# Altium project pca10090.PrjPCB (part 2 of 5)

## Sheet pca10090_sheet3_nrf52840.SchDoc: PCA10090 - nRF52840
size A3; Organization: Nordic Semiconductor; DocumentNumber: 3; Revision: 0.15.0; SheetNumber: 3; SheetTotal: 8; Author: RUBR; CompanyName: Nordic Semiconductor; DrawnBy: RUBR; DocumentSize: A3; ProjectName: nRF9160-DK
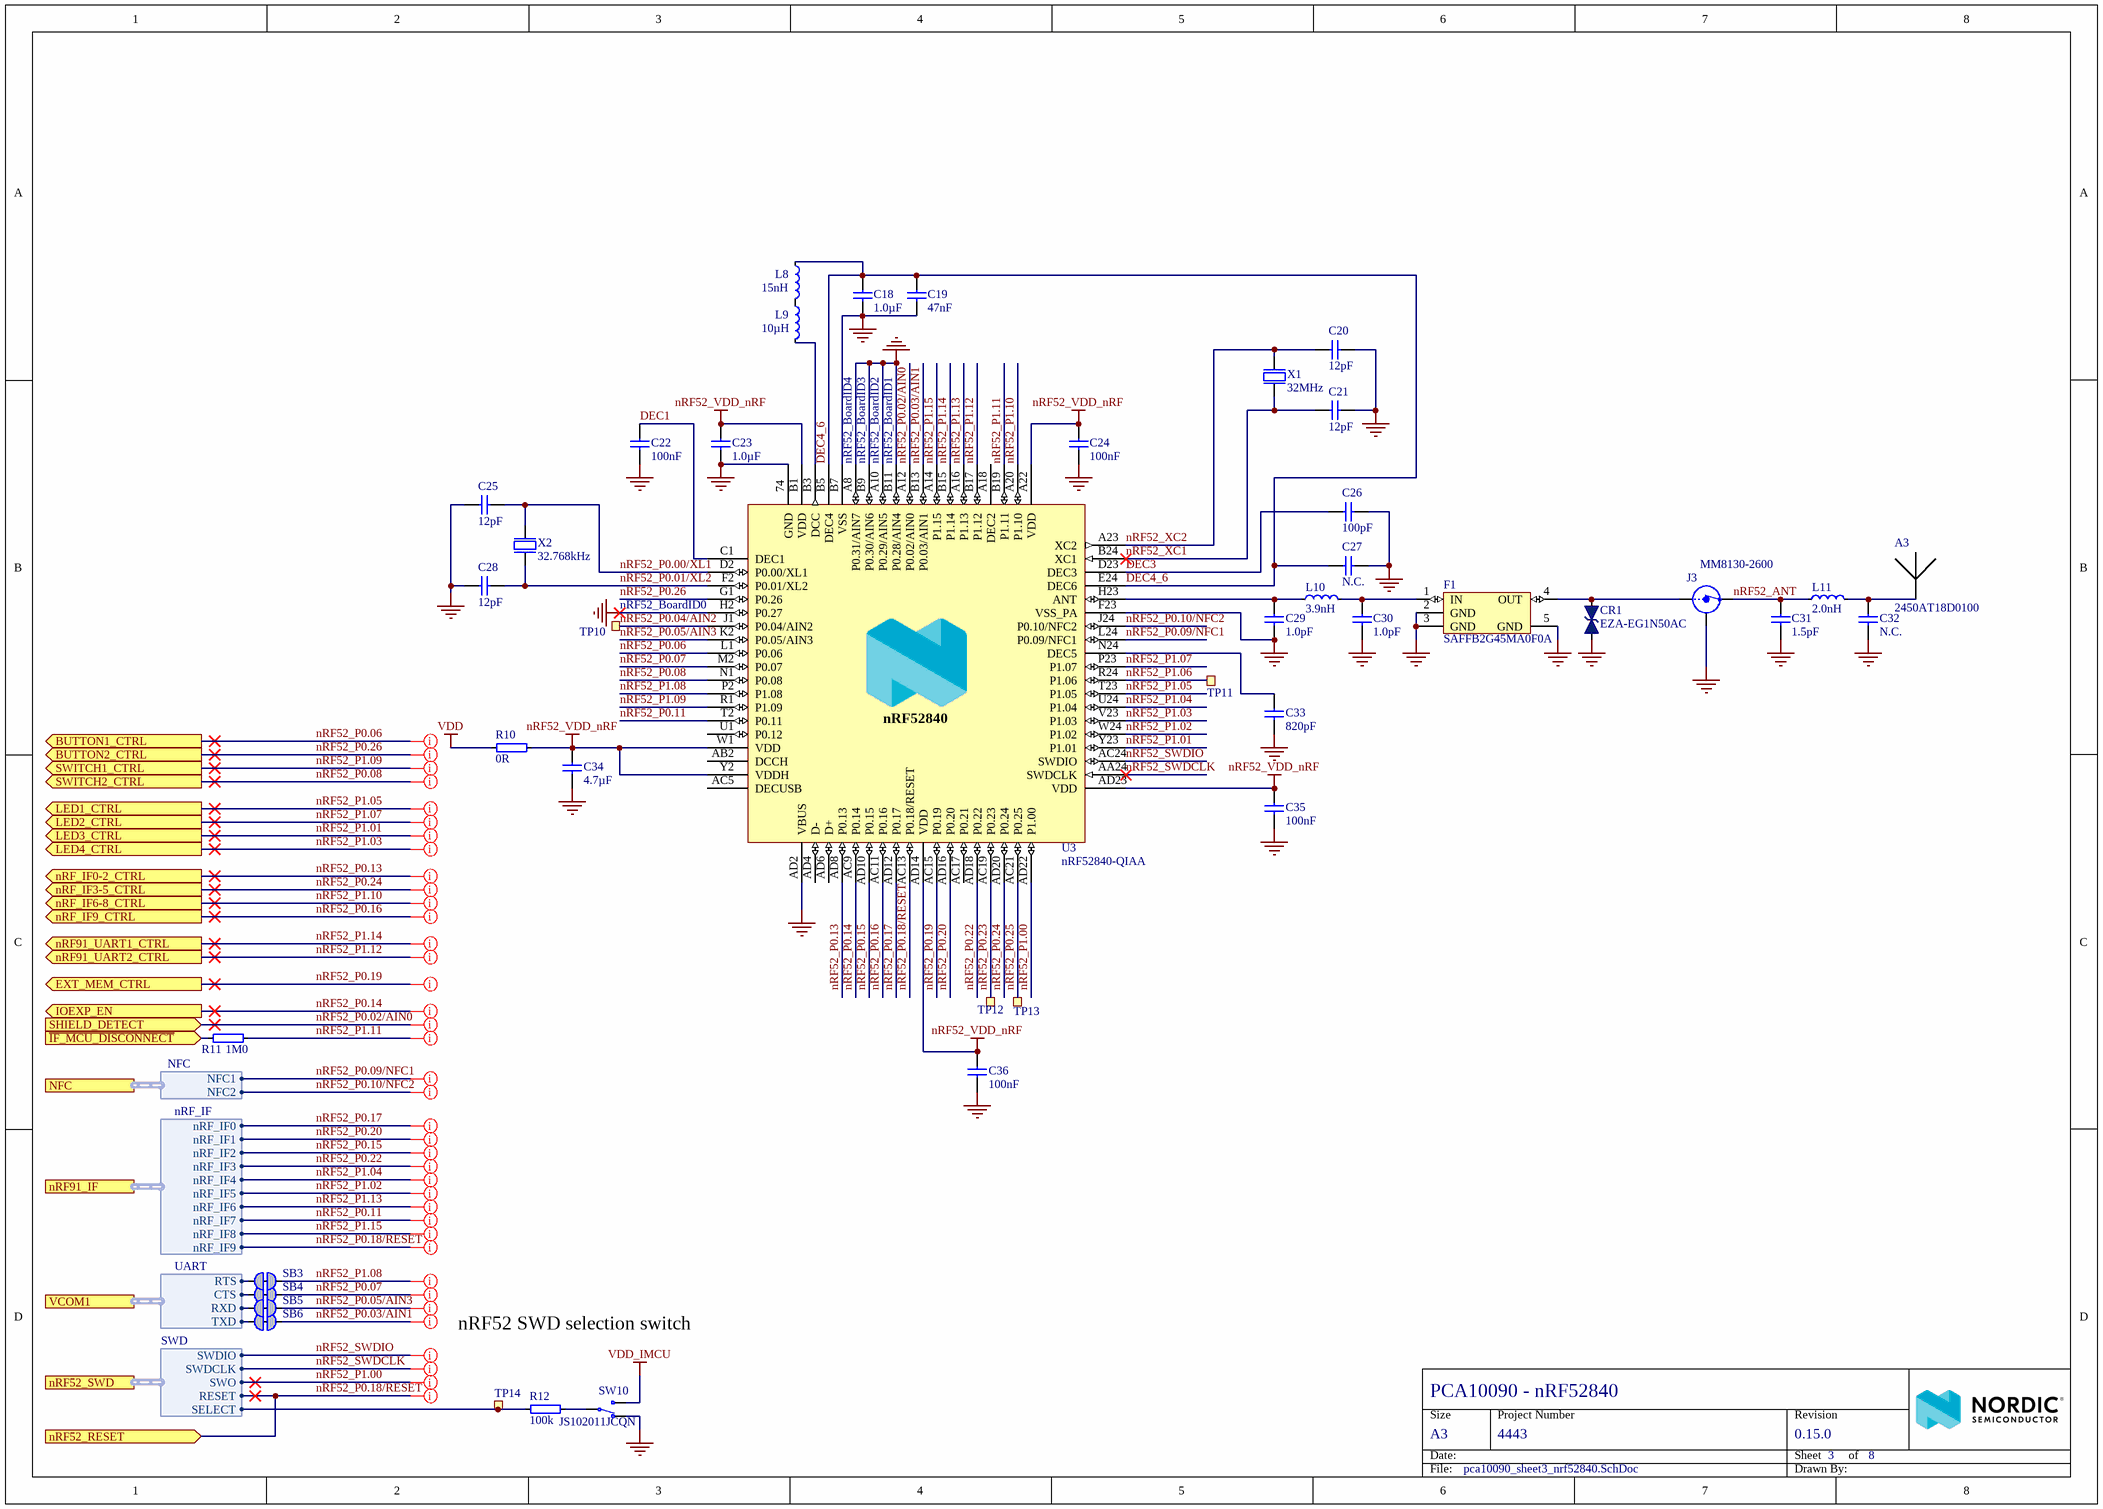
[diagram p2: pca10090_sheet3_nrf52840.SchDoc]

### Parts
A3  2450AT18D0100  [2450AT18D0100_STD-L]
C18  1.0µF  [CAPC1005X04L]
C19  47nF  [CAPC0603X03L_C]
C20  12pF  [CAPC0603X03L_C]
C21  12pF  [CAPC0603X03L_C]
C22  100nF  [CAPC0603X03L_C]
C23  1.0µF  [CAPC1005X04L]
C24  100nF  [CAPC0603X03L_C]
C25  12pF  [CAPC0603X03L_C]
C26  100pF  [CAPC0603X03L_C]
C27  N.C.  [CAPC0603X03L_C_NC]
C28  12pF  [CAPC0603X03L_C]
C29  1.0pF  [CAPC0603X03L_C]
C30  1.0pF  [CAPC0603X03L_C]
C31  1.5pF  [CAPC0603X03L_C]
C32  N.C.  [CAPC0603X03L_C_NC]
C33  820pF  [CAPC0603X03L_C]
C34  4.7µF  [CAPC1608X06L]
C35  100nF  [CAPC0603X03L_C]
C36  100nF  [CAPC0603X03L_C]
CR1  EZA-EG1N50AC  [RESC0603X03L_C]
F1  SAFFB2G45MA0F0A  [SAFFB2G45MA0F0A]
J3  MM8130-2600  [COAXIAL-SWF]
L8  15nH  [INDC1005X04L]
L9  10µH  [INDC1608X06L]
L10  3.9nH  [INDC0603X03L_C]
L11  2.0nH  [INDC0603X03L_C]
R10  0R  [RESC0603X03L_C]
R11  1M0  [RESC0603X03L_C]
R12  100k  [RESC0603X03L_C]
SB3  Solderbridge  [Solderbridge_Shorted]  (value not drawn)  (net tie, no BOM)
SB4  Solderbridge  [Solderbridge_Shorted]  (value not drawn)  (net tie, no BOM)
SB5  Solderbridge  [Solderbridge_Shorted]  (value not drawn)  (net tie, no BOM)
SB6  Solderbridge  [Solderbridge_Shorted]  (value not drawn)  (net tie, no BOM)
SW10  JS102011JCQN  [JS102011JCQN]
TP10  Ø1.5mm,SMD  [TP_SMD_Ø1.5mm]  (value not drawn)  (no BOM)
TP11  Ø1.5mm,SMD  [TP_SMD_Ø1.5mm]  (value not drawn)  (no BOM)
TP12  Ø1.5mm,SMD  [TP_SMD_Ø1.5mm]  (value not drawn)  (no BOM)
TP13  Ø1.5mm,SMD  [TP_SMD_Ø1.5mm]  (value not drawn)  (no BOM)
TP14  Ø1.5mm,SMD  [TP_SMD_Ø1.5mm]  (value not drawn)  (no BOM)
U3  nRF52840-QIAA  [AQFN50P700X700X85_HS-74N]
X1  32MHz  [BT-XTAL_2016]
X2  32.768kHz  [XTAL_3215]

### Ports
BUTTON1_CTRL (out), BUTTON2_CTRL (out), EXT_MEM_CTRL (out), IOEXP_EN (out), LED1_CTRL (out), LED2_CTRL (out), LED3_CTRL (out), LED4_CTRL (out), NFC (harness NFC), nRF52_RESET (in), nRF52_SWD (harness SWD), nRF91_IF (harness nRF_IF), nRF91_UART1_CTRL (out), nRF91_UART2_CTRL (out), nRF_IF0-2_CTRL (out), nRF_IF3-5_CTRL (out), nRF_IF6-8_CTRL (out), nRF_IF9_CTRL (out), SHIELD_DETECT (in), SWITCH1_CTRL (out), SWITCH2_CTRL (out), VCOM1 (harness UART), ~{IF_MCU_DISCONNECT} (in)

### Harnesses
UART: RTS, CTS, RXD, TXD
NFC: NFC1, NFC2
SWD: SWDIO, SWDCLK, SWO, RESET, SELECT
nRF_IF: nRF_IF0, nRF_IF1, nRF_IF2, nRF_IF3, nRF_IF4, nRF_IF5, nRF_IF6, nRF_IF7, nRF_IF8, nRF_IF9

### Nets
GND: A3.2(GND) C18.1 C19.1 C20.2 C21.2 C22.1 C23.1 C24.1 C25.1 C26.2 C27.1 C28.2 C29.1 C30.1 C31.2 C32.1 C33.1 C34.1 C35.1 C36.1 CR1.1 F1.2(GND) F1.3(GND) F1.5(GND) J3.2(Shield) SW10.1(N.C) U3.74(GND) U3.A8(P0.31/AIN7) U3.A10(P0.29/AIN5) U3.AD2(VBUS) U3.B7(VSS) U3.B9(P0.30/AIN6) U3.B11(P0.28/AIN4) U3.F23(VSS_PA) U3.H2(P0.27) X1.2(GND) X1.4(GND)
nRF52_VDD_nRF: C23.2 C24.2 C34.2 C35.2 C36.2 R10.2 U3.A22(VDD) U3.AD14(VDD) U3.AD23(VDD) U3.B1(VDD) U3.W1(VDD) U3.Y2(VDDH)
VDD: R10.1
VDD_IMCU: SW10.3(N.O)
DEC1: C22.2 U3.C1(DEC1)
DEC3: C26.1 U3.D23(DEC3)
DEC4_6: C18.2 C19.2 C27.2 L8.1 U3.B5(DEC4) U3.E24(DEC6)
~{IF_MCU_DISCONNECT}: R11.2 ; port ~{IF_MCU_DISCONNECT}
nRF52_ANT: C31.1 J3.3(OUT) L11.1
nRF52_P0.00/XL1: C25.2 U3.D2(P0.00/XL1) X2.1(inp)
nRF52_P0.01/XL2: C28.1 U3.F2(P0.01/XL2) X2.2(out)
nRF52_P0.02/AIN0: U3.A12(P0.02/AIN0) ; port SHIELD_DETECT
nRF52_P0.03/AIN1: SB6.1 U3.B13(P0.03/AIN1)
nRF52_P0.04/AIN2: TP10.1 U3.J1(P0.04/AIN2)
nRF52_P0.05/AIN3: SB5.1 U3.K2(P0.05/AIN3)
nRF52_P0.06: U3.L1(P0.06) ; port BUTTON1_CTRL
nRF52_P0.07: SB4.1 U3.M2(P0.07)
nRF52_P0.08: U3.N1(P0.08) ; port SWITCH2_CTRL
nRF52_P0.09/NFC1: U3.L24(P0.09/NFC1) ; port NFC.NFC1
nRF52_P0.10/NFC2: U3.J24(P0.10/NFC2) ; port NFC.NFC2
nRF52_P0.11: U3.T2(P0.11) ; port nRF91_IF.nRF_IF7
nRF52_P0.13: U3.AD8(P0.13) ; port nRF_IF0-2_CTRL
nRF52_P0.14: U3.AC9(P0.14) ; port IOEXP_EN  [project net IOEXP_EN]
nRF52_P0.15: U3.AD10(P0.15) ; port nRF91_IF.nRF_IF2
nRF52_P0.16: U3.AC11(P0.16) ; port nRF_IF9_CTRL
nRF52_P0.17: U3.AD12(P0.17) ; port nRF91_IF.nRF_IF0
nRF52_P0.18/RESET: U3.AC13(P0.18/RESET) ; port nRF52_RESET, port nRF52_SWD.RESET, port nRF91_IF.nRF_IF9
nRF52_P0.19: U3.AC15(P0.19) ; port EXT_MEM_CTRL
nRF52_P0.20: U3.AD16(P0.20) ; port nRF91_IF.nRF_IF1
nRF52_P0.22: U3.AD18(P0.22) ; port nRF91_IF.nRF_IF3
nRF52_P0.23: TP12.1 U3.AC19(P0.23)
nRF52_P0.24: U3.AD20(P0.24) ; port nRF_IF3-5_CTRL
nRF52_P0.25: TP13.1 U3.AC21(P0.25)
nRF52_P0.26: U3.G1(P0.26) ; port BUTTON2_CTRL
nRF52_P1.00: U3.AD22(P1.00) ; port nRF52_SWD.SWO
nRF52_P1.01: U3.Y23(P1.01) ; port LED3_CTRL
nRF52_P1.02: U3.W24(P1.02) ; port nRF91_IF.nRF_IF5
nRF52_P1.03: U3.V23(P1.03) ; port LED4_CTRL
nRF52_P1.04: U3.U24(P1.04) ; port nRF91_IF.nRF_IF4
nRF52_P1.05: U3.T23(P1.05) ; port LED1_CTRL
nRF52_P1.06: TP11.1 U3.R24(P1.06)
nRF52_P1.07: U3.P23(P1.07) ; port LED2_CTRL
nRF52_P1.08: SB3.1 U3.P2(P1.08)
nRF52_P1.09: U3.R1(P1.09) ; port SWITCH1_CTRL
nRF52_P1.10: U3.A20(P1.10) ; port nRF_IF6-8_CTRL
nRF52_P1.11: R11.1 U3.B19(P1.11)
nRF52_P1.12: U3.B17(P1.12) ; port nRF91_UART2_CTRL
nRF52_P1.13: U3.A16(P1.13) ; port nRF91_IF.nRF_IF6
nRF52_P1.14: U3.B15(P1.14) ; port nRF91_UART1_CTRL
nRF52_P1.15: U3.A14(P1.15) ; port nRF91_IF.nRF_IF8
nRF52_SWDCLK: U3.AA24(SWDCLK) ; port nRF52_SWD.SWDCLK
nRF52_SWDIO: U3.AC24(SWDIO) ; port nRF52_SWD.SWDIO
nRF52_XC1: C21.1 U3.B24(XC1) X1.1(inp)
nRF52_XC2: C20.1 U3.A23(XC2) X1.3(out)
SWD2_SEL: R12.2 TP14.1 ; port nRF52_SWD.SELECT
VCOM1_CTS: SB4.2 ; port VCOM1.CTS
VCOM1_RTS: SB3.2 ; port VCOM1.RTS
VCOM1_RxD: SB5.2 ; port VCOM1.RXD
VCOM1_TxD: SB6.2 ; port VCOM1.TXD
NetA3_1: A3.1 C32.2 L11.2
NetC29_2: C29.2 L10.1 U3.H23(ANT)
NetC30_2: C30.2 F1.1(IN) L10.2
NetC33_2: C33.2 U3.N24(DEC5)
NetCR1_2: CR1.2 F1.4(OUT) J3.1(IN)
NetL8_2: L8.2 L9.1
NetL9_2: L9.2 U3.B3(DCC)
NetR12_1: R12.1 SW10.2(COM)

Not connected (* = marked no-connect by the designer): U3 A18(DEC2) AB2(DCCH) AC5(DECUSB) AC17(P0.21) AD4(D-) AD6(D+) U1(P0.12)

### Layout directives
net class GPIO: IOEXP_EN, nRF52_P0.02/AIN0, nRF52_P0.03/AIN1, nRF52_P0.05/AIN3, nRF52_P0.06, nRF52_P0.07, nRF52_P0.08, nRF52_P0.09/NFC1, nRF52_P0.10/NFC2, nRF52_P0.11, nRF52_P0.13, nRF52_P0.15, nRF52_P0.16, nRF52_P0.17, nRF52_P0.18/RESET, nRF52_P0.19, nRF52_P0.20, nRF52_P0.22, nRF52_P0.24, nRF52_P0.26, nRF52_P1.01, nRF52_P1.02, nRF52_P1.03, nRF52_P1.04, nRF52_P1.05, nRF52_P1.07, nRF52_P1.08, nRF52_P1.09, nRF52_P1.10, nRF52_P1.11, nRF52_P1.12, nRF52_P1.13, nRF52_P1.14, nRF52_P1.15
net class SWD: nRF52_P0.18/RESET, nRF52_P1.00, nRF52_SWDCLK, nRF52_SWDIO

### Notes on the sheet
- nRF52_BoardID4
- (near U3) nRF52_BoardID3
- (near U3) nRF52_BoardID2
- (near U3) nRF52_BoardID1
- (near TP10) nRF52_BoardID0
- nRF52 SWD selection switch
- Size
- Date:
- A3
- Project Number
- Sheet         of
- Revision
- File:
- Drawn By:
- (in symbol nRF52840-QIAAD0) nRF52840

### Library data of the parts
A3 = Johanson 2450AT18D0100_STD-L: 2.45 GHz chip antenna; Manufacturer: Johanson Technology; Part number IPS: 00000001415; Artikkelnr Noca: 53059035; Part Number: Johanson 2450AT18D0100_STD-L; Manufacturer Part Number: 2450AT18D0100; ComponentLink1URL: *; ComponentLink1Description: Datasheet; ComponentLink2URL: *; ComponentLink2Description: Supplier link; HelpURL: http://www.johansontechnology.com/datasheets/antennas/2450AT18D0100.pdf; Footprint Doc: 2450AT18D0100; LatestRevisionDate: 2016-06-02; Pin Count: 4; Publisher: Nordic Semiconductor; Published: 2016-01-12; Value: 2450AT18D0100; Note: *; Supplier 1: Digi-Key; Supplier Part Number 1: 2450AT18D0100E; Supplier 2: Mouser; Supplier Part Number 2: 609-2450AT18D0100E
C18 C23 = C0402-1µ0: Capacitor, X5R, ±5%, 6.3V; Part number IPS: 00000007786, 00000003457; Artikkelnr Noca: 20039235; Part Number: C0402-1µ0; Manufacturer: *; Manufacturer Part Number: *; ComponentLink1URL: *; ComponentLink1Description: Datasheet; ComponentLink2URL: *; ComponentLink2Description: Supplier link; HelpURL: *; Footprint Doc: 0402; LatestRevisionDate: 2016-08-22; Pin Count: 2; Publisher: Nordic Semiconductor; Published: 2009-05-08; Value: 1.0µF; Note: 6.3V; Supplier 1: Digi-Key; Supplier Part Number 1: 1276-1444-1-ND; Supplier 2: *; Supplier Part Number 2: *
C19 = C0201-47n: Capacitor, X5R, ±10%; Part number IPS: 00000001250; Note: 10V; Artikkelnr Noca: N.A.; Part Number: C0201-47n; Manufacturer: *; Manufacturer Part Number: *; ComponentLink1URL: *; ComponentLink1Description: Datasheet; ComponentLink2URL: *; ComponentLink2Description: Supplier link; HelpURL: *; Footprint Doc: 0201; LatestRevisionDate: 2017-11-09; Pin Count: 2; Publisher: Nordic Semiconductor; Published: 2014-11-13; Value: 47nF; Supplier 1: *; Supplier Part Number 1: *; Supplier 2: *; Supplier Part Number 2: *
C20 C21 C25 C28 = C0201-12p: Capacitor, NP0, ±2%; Part number IPS: 00000007848; Note: 25V; Artikkelnr Noca: N.A.; Part Number: C0201-12p; Manufacturer: *; Manufacturer Part Number: *; ComponentLink1URL: *; ComponentLink1Description: Datasheet; ComponentLink2URL: *; ComponentLink2Description: Supplier link; HelpURL: *; Footprint Doc: 0201; LatestRevisionDate: 2017-11-09; Pin Count: 2; Publisher: Nordic Semiconductor; Published: 2014-11-13; Value: 12pF; Supplier 1: *; Supplier Part Number 1: *; Supplier 2: *; Supplier Part Number 2: *
C22 C24 C35 C36 = C0201-100n: Capacitor, X5R, ±10%; Part number IPS: 00000001248, 00000002505; Note: 16V; Artikkelnr Noca: N.A.; Part Number: C0201-100n; Manufacturer: *; Manufacturer Part Number: *; ComponentLink1URL: *; ComponentLink1Description: Datasheet; ComponentLink2URL: *; ComponentLink2Description: Supplier link; HelpURL: *; Footprint Doc: 0201; LatestRevisionDate: 2017-11-09; Pin Count: 2; Publisher: Nordic Semiconductor; Published: 2014-11-13; Value: 100nF; Supplier 1: *; Supplier Part Number 1: *; Supplier 2: *; Supplier Part Number 2: *
C26 = C0201-100p: Capacitor, NP0, ±2%, 25V; Manufacturer: Murata; Manufacturer Part Number: GRM0335C1E101GA01; Part number IPS: 00000007853; Artikkelnr Noca: N.A.; Part Number: C0201-100p; ComponentLink1URL: *; ComponentLink1Description: Datasheet; ComponentLink2URL: *; ComponentLink2Description: Supplier link; HelpURL: *; Footprint Doc: 0201; LatestRevisionDate: 2019-04-16; Pin Count: 2; Publisher: Nordic Semiconductor; Published: 2019-04-16; Value: 100pF; Note: 25V; Supplier 1: *; Supplier Part Number 1: *; Supplier 2: *; Supplier Part Number 2: *
C27 C32 = C0201-N.C.: Not mounted; Note: Chip Cap; Artikkelnr Noca: N.A.; Assembly: Not mounted; Part Number: C0201-N.C.; Manufacturer: *; Manufacturer Part Number: *; ComponentLink1URL: *; ComponentLink1Description: Datasheet; ComponentLink2URL: *; ComponentLink2Description: Supplier link; HelpURL: *; Footprint Doc: 0201; LatestRevisionDate: 2014-11-13; Pin Count: 2; Publisher: Nordic Semiconductor; Published: 2014-11-13; Value: N.C.; Part number IPS: N.A.; Supplier 1: *; Supplier Part Number 1: *; Supplier 2: *; Supplier Part Number 2: *
C29 C30 = C0201-1.0p: Capacitor, NP0, ±0.05pF, 50V; Part number IPS: 00000001247; Artikkelnr Noca: N.A.; Part Number: C0201-1.0p; Manufacturer: *; Manufacturer Part Number: *; ComponentLink1URL: *; ComponentLink1Description: Datasheet; ComponentLink2URL: *; ComponentLink2Description: Supplier link; HelpURL: *; Footprint Doc: 0201; LatestRevisionDate: 2018-10-22; Pin Count: 2; Publisher: Nordic Semiconductor; Published: 2014-11-13; Value: 1.0pF; Note: 50V; Supplier 1: *; Supplier Part Number 1: *; Supplier 2: *; Supplier Part Number 2: *
C31 = C0201-1.5p: Capacitor, NP0, ±0.1pF; Part number IPS: 00000007107; Note: 50V; Artikkelnr Noca: N.A.; Part Number: C0201-1.5p; Manufacturer: *; Manufacturer Part Number: *; ComponentLink1URL: *; ComponentLink1Description: Datasheet; ComponentLink2URL: *; ComponentLink2Description: Supplier link; HelpURL: *; Footprint Doc: 0201; LatestRevisionDate: 2017-11-09; Pin Count: 2; Publisher: Nordic Semiconductor; Published: 2014-11-13; Value: 1.5pF; Supplier 1: *; Supplier Part Number 1: *; Supplier 2: *; Supplier Part Number 2: *
C33 = C0201-820p: Capacitor, X7R, ±10%; Part number IPS: 00000001249; Note: 25V; Artikkelnr Noca: N.A.; Part Number: C0201-820p; Manufacturer: *; Manufacturer Part Number: *; ComponentLink1URL: *; ComponentLink1Description: Datasheet; ComponentLink2URL: *; ComponentLink2Description: Supplier link; HelpURL: *; Footprint Doc: 0201; LatestRevisionDate: 2017-11-09; Pin Count: 2; Publisher: Nordic Semiconductor; Published: 2014-11-13; Value: 820pF; Supplier 1: *; Supplier Part Number 1: *; Supplier 2: *; Supplier Part Number 2: *
C34 = C0603-4µ7: Capacitor, X5R, ±10%; Part number IPS: 00000007783; Note: 6.3V; Artikkelnr Noca: 20069060; Part Number: C0603-4µ7; Manufacturer: *; Manufacturer Part Number: *; ComponentLink1URL: *; ComponentLink1Description: Datasheet; ComponentLink2URL: *; ComponentLink2Description: Supplier link; HelpURL: *; Footprint Doc: 0603; LatestRevisionDate: 2009-11-23; Pin Count: 2; Publisher: Nordic Semiconductor; Published: 2009-05-08; Value: 4.7µF; Supplier 1: *; Supplier Part Number 1: *; Supplier 2: *; Supplier Part Number 2: *
CR1 = EZA-EG1N50AC: ESD Suppressor, 30V, 0.04pF; Manufacturer: Panasonic; Artikkelnr Noca: N.A.; Part Number: EZA-EG1N50AC; Manufacturer Part Number: EZA-EG1N50AC; ComponentLink1URL: https://industrial.panasonic.com/cdbs/www-data/pdf/AWD0000/AWD0000C13.pdf; ComponentLink1Description: Datasheet; ComponentLink2URL: *; ComponentLink2Description: Supplier link; HelpURL: *; Footprint Doc: 0201; LatestRevisionDate: 2020-02-06; Pin Count: 2; Publisher: Nordic Semiconductor; Published: 2020-02-06; Value: EZA-EG1N50AC; Note: *; Part number IPS: N.A.; Supplier 1: Digi-Key; Supplier Part Number 1: P122037CT-ND; Supplier 2: *; Supplier Part Number 2: *
F1 = SAFFB2G45MA0F0A: 2.4 GHz BPF; Manufacturer: Murata; Part number IPS: 00000001784, 80000001660; Artikkelnr Noca: N.A.; Part Number: SAFFB2G45MA0F0A; Manufacturer Part Number: SAFFB2G45MA0F0A; ComponentLink1URL: *; ComponentLink1Description: Datasheet; ComponentLink2URL: *; ComponentLink2Description: Supplier link; HelpURL: *; Footprint Doc: 1109; LatestRevisionDate: 2018-05-15; Pin Count: 5; Publisher: Nordic Semiconductor; Published: 2018-05-15; Value: SAFFB2G45MA0F0A; Supplier 1: *; Supplier Part Number 1: *; Supplier 2: *; Supplier Part Number 2: *
J3 = MM8130-2600: Coaxial Connector with Switch; Manufacturer: Murata; Part number IPS: 00000009955; Artikkelnr Noca: 55029011; Part Number: MM8130-2600; Manufacturer Part Number: MM8130-2600; LatestRevisionDate: 2014-04-24; Pin Count: 3; Publisher: Nordic Semiconductor; Published: 2014-04-24; Value: MM8130-2600; Note: *; Footprint Doc: COAXIAL-SWF; ComponentLink1URL: *; ComponentLink1Description: Datasheet; ComponentLink2URL: *; ComponentLink2Description: Supplier link; HelpURL: http://www.murata.com/products/catalog/pdf/o33e.pdf; Supplier 1: Digi-Key; Supplier Part Number 1: 490-4981-1-ND; Supplier 2: Mouser; Supplier Part Number 2: 81-MM8130-2600RA2
L8 = L0402-15n: Inductor, 320mA, ±5%; Manufacturer: Taiyo Yuden; Manufacturer Part Number: HK100515NJ-T; Part number IPS: 00000001262; Note: High frequency chip inductor ±10%; Artikkelnr Noca: 33029323; Part Number: L0402-15n; LatestRevisionDate: 2012-09-19; Pin Count: 2; Publisher: Nordic Semiconductor; Published: 2010-07-12; Value: 15nH; Footprint Doc: 0402; ComponentLink1Description: Datasheet; ComponentLink2Description: Supplier link; ComponentLink1URL: *; ComponentLink2URL: *; HelpURL: http://www.yuden.co.jp/productdata/catalog/en/mlci04_e.pdf; Supplier 1: Digi-Key; Supplier Part Number 1: 587-1521-1-ND; Supplier 2: Farnell; Supplier Part Number 2: 658-1328
L9 = L0603-10µ: Inductor, 80mA, ±10%; Manufacturer: Taiyo Yuden; Manufacturer Part Number: LBMF1608T100K; Part number IPS: 00000007794; Note: LBMF1608T100K 10µH 80mA 0603; Artikkelnr Noca: 33029314; Part Number: L0603-10µ; LatestRevisionDate: 2012-09-19; Pin Count: 2; Publisher: Nordic Semiconductor; Published: 2010-02-24; Value: 10µH; Footprint Doc: 0603; ComponentLink1Description: Datasheet; ComponentLink2Description: Supplier link; ComponentLink1URL: *; ComponentLink2URL: *; HelpURL: http://www.yuden.co.jp/ut/product/pdf/elb2_e.pdf; Supplier 1: Digi-Key; Supplier Part Number 1: 587-1714-1-ND; Supplier 2: Farnell; Supplier Part Number 2: 178-6105
L10 = L0201-3n9: Inductor, 400mA, ±0.1nH; Manufacturer: Murata; Manufacturer Part Number: LQP03TN3N9B02D; Part number IPS: 00000001253; Artikkelnr Noca: N.A.; Part Number: L0201-3n9; ComponentLink1URL: *; ComponentLink1Description: Datasheet; ComponentLink2Description: Supplier link; HelpURL: *; Footprint Doc: 0201; LatestRevisionDate: 2017-11-09; Pin Count: 2; Publisher: Nordic Semiconductor; Published: 2013-04-10; Value: 3.9nH; Note: *; ComponentLink2URL: *; Supplier 1: *; Supplier Part Number 1: *; Supplier 2: *; Supplier Part Number 2: *
L11 = L0201-2n0: Chip Inductor; Manufacturer: Murata; Manufacturer Part Number: LQP03TN2N0B02D; Part number IPS: 00000001670; Note: High frequency chip inductor ±5%; Artikkelnr Noca: N.A.; Part Number: L0201-2n0; ComponentLink1URL: *; ComponentLink1Description: Datasheet; ComponentLink2URL: *; ComponentLink2Description: Supplier link; HelpURL: http://www.murata.com/~/media/webrenewal/support/library/catalog/products/inductor/chip/o05e.ashx; Footprint Doc: 0201; LatestRevisionDate: 2016-04-19; Pin Count: 2; Publisher: Nordic Semiconductor; Published: 2016-04-19; Value: 2.0nH; Supplier 1: Digi-Key; Supplier Part Number 1: 490-12983-1-ND; Supplier 2: *; Supplier Part Number 2: *
R10 = R0201-0R: Resistor, ±5%, 0.05W; Part number IPS: 00000003245; Note: Chip Res 5%; Artikkelnr Noca: N.A.; Part Number: R0201-0R; Manufacturer: *; Manufacturer Part Number: *; ComponentLink1URL: *; ComponentLink1Description: Datasheet; ComponentLink2URL: *; ComponentLink2Description: Supplier link; HelpURL: *; Footprint Doc: 0201; LatestRevisionDate: 2017-11-09; Pin Count: 2; Publisher: Nordic Semiconductor; Published: 2014-11-13; Value: 0R; Supplier 1: *; Supplier Part Number 1: *; Supplier 2: *; Supplier Part Number 2: *
R11 = R0201-1M0: Resistor, ±1%, 0.05W; Part number IPS: 00000001418; Note: Chip Res 1%; Artikkelnr Noca: N.A.; Part Number: R0201-1M0; Manufacturer: *; Manufacturer Part Number: *; ComponentLink1URL: *; ComponentLink1Description: Datasheet; ComponentLink2URL: *; ComponentLink2Description: Supplier link; HelpURL: *; Footprint Doc: 0201; LatestRevisionDate: 2014-11-13; Pin Count: 2; Publisher: Nordic Semiconductor; Published: 2014-11-13; Value: 1M0; Supplier 1: *; Supplier Part Number 1: *; Supplier 2: *; Supplier Part Number 2: *
R12 = R0201-100k: Resistor, ±1%, 0.05W; Part number IPS: 00000001419; Note: Chip Res 1%; Artikkelnr Noca: N.A.; Part Number: R0201-100k; Manufacturer: *; Manufacturer Part Number: *; ComponentLink1URL: *; ComponentLink1Description: Datasheet; ComponentLink2URL: *; ComponentLink2Description: Supplier link; HelpURL: *; Footprint Doc: 0201; LatestRevisionDate: 2014-11-13; Pin Count: 2; Publisher: Nordic Semiconductor; Published: 2014-11-13; Value: 100k; Supplier 1: *; Supplier Part Number 1: *; Supplier 2: *; Supplier Part Number 2: *
SB3-SB6 = Solderbridge Shorted: Shorted Solderbridge; Artikkelnr Noca: N.A.; Part Number: Solderbridge Shorted; Manufacturer: *; Manufacturer Part Number: *; Footprint Doc: Solderbridge_Shorted; LatestRevisionDate: 2012-08-07; Pin Count: 2; Publisher: Nordic Semiconductor; Published: 2012-08-07; Value: Solderbridge; Note: *; Part number IPS: N.A.; ComponentLink1URL: *; ComponentLink1Description: Datasheet; ComponentLink2URL: *; ComponentLink2Description: Supplier link; HelpURL: *; Supplier 1: *; Supplier Part Number 1: *; Supplier 2: *; Supplier Part Number 2: *
SW10 = JS102011JCQN: SWITCH SLIDE SPDT 300MA 6V; Manufacturer: C&K Components; Part number IPS: 00000009980; Artikkelnr Noca: N.A.; Part Number: JS102011JCQN; Manufacturer Part Number: JS102011JCQN; LatestRevisionDate: 2017-02-15; Pin Count: 3; Publisher: Nordic Semiconductor; Published: 2017-02-15; Value: JS102011JCQN; Note: *; ComponentLink1URL: *; ComponentLink1Description: Datasheet; ComponentLink2URL: *; ComponentLink2Description: Supplier link; HelpURL: http://www.ckswitches.com/media/1422/js.pdf; Footprint Doc: *; Supplier 1: Digi-Key; Supplier Part Number 1: CKN10721CT-ND; Supplier 2: Mouser; Supplier Part Number 2: 611-JS102011JCQN
TP10-TP14 = TP_SMD_Ø1.5MM: 1.5mm circular SMD testpad; Manufacturer: Nordic Semiconductor; Artikkelnr Noca: N.A.; Part Number: TP_SMD_Ø1.5MM; Manufacturer Part Number: *; ComponentLink1URL: *; ComponentLink1Description: Datasheet; ComponentLink2URL: *; ComponentLink2Description: Supplier link; HelpURL: *; Footprint Doc: TP_SMD_Ø1.5mm; LatestRevisionDate: 2016-06-02; Pin Count: 1; Publisher: Nordic Semiconductor; Published: 2016-06-02; Value: Ø1.5mm,SMD; Note: *; Part number IPS: N.A.; Supplier 1: *; Supplier Part Number 1: *; Supplier 2: *; Supplier Part Number 2: *
U3 = nRF52840-QIAAD0: Multi-protocol Bluetooth Low Energy, IEEE 802.15.4, ANT and 2.4GHz proprietary system-on-chip; Manufacturer: Nordic Semiconductor; Part number IPS: 80000001648; Artikkelnr Noca: N.A.; Part Number: nRF52840-QIAAD0; Manufacturer Part Number: nRF52840-QIAAD0; LatestRevisionDate: 2018-12-04; Pin Count: 73; Publisher: Nordic Semiconductor; Published: 2018-12-04; Value: nRF52840-QIAA; Note: *; Footprint Doc: AQFN-73; ComponentLink1URL: *; ComponentLink1Description: Datasheet; ComponentLink2URL: *; ComponentLink2Description: Supplier link; HelpURL: *; Supplier 1: Nordic Semiconductor; Supplier Part Number 1: nRF52840-QIAAD0; Supplier 2: *; Supplier Part Number 2: *
X1 = XTAL_SMD2016_32MHz_8pF_Golledge: XTAL SMD 2016, 32MHz, Cl=8pF, Tol: ±10ppm, Stab: ±15ppm; Manufacturer Part Number: MP06003; Part number IPS: 00000001431; Note: XTAL SMD 32.000MHz; Artikkelnr Noca: 22010050; Part Number: XTAL_SMD2016_32MHz_8pF_Golledge; LatestRevisionDate: 2016-11-02; Pin Count: 4; Publisher: Nordic Semiconductor; Published: 2016-11-02; Value: 32MHz; Footprint Doc: XTAL_2016; Manufacturer: Golledge; ComponentLink1URL: *; ComponentLink1Description: Datasheet; ComponentLink2URL: *; ComponentLink2Description: Supplier link; HelpURL: \\hizz\pro\app9717\Datasheet\crystals\Golledge\mp06003.pdf; Supplier 1: Link Nordic; Supplier Part Number 1: *; Supplier 2: *; Supplier Part Number 2: *
X2 = XTAL_SMD3215_32.768kHz_9pF_NDK: XTAL SMD 3215, 32.768kHz, 9pF, ±20ppm; Manufacturer: NDK; Manufacturer Part Number: NX3215SA-32.768K-STD-MUA-9; Part number IPS: 00000005419; Note: XTAL SMD 32.768kHz; Artikkelnr Noca: 22010049; Part Number: XTAL_SMD3215_32.768kHz_9pF_NDK; LatestRevisionDate: 2017-10-23; Pin Count: 2; Publisher: Nordic Semiconductor; Published: 2017-10-23; Value: 32.768kHz; Footprint Doc: XTAL_3215; ComponentLink1URL: *; ComponentLink1Description: Datasheet; ComponentLink2URL: *; ComponentLink2Description: Supplier link; HelpURL: *; Supplier 1: *; Supplier Part Number 1: *; Supplier 2: *; Supplier Part Number 2: *

## Sheet pca10090_sheet4_interface_mcu.SchDoc: PCA10090 - Interface MCU
size A3; Organization: Nordic Semiconductor; DocumentNumber: 4; Revision: 0.15.0; SheetNumber: 4; SheetTotal: 8; Author: RUBR; CompanyName: Nordic Semiconductor; DrawnBy: RUBR; DocumentSize: A3; ProjectName: nRF9160-DK
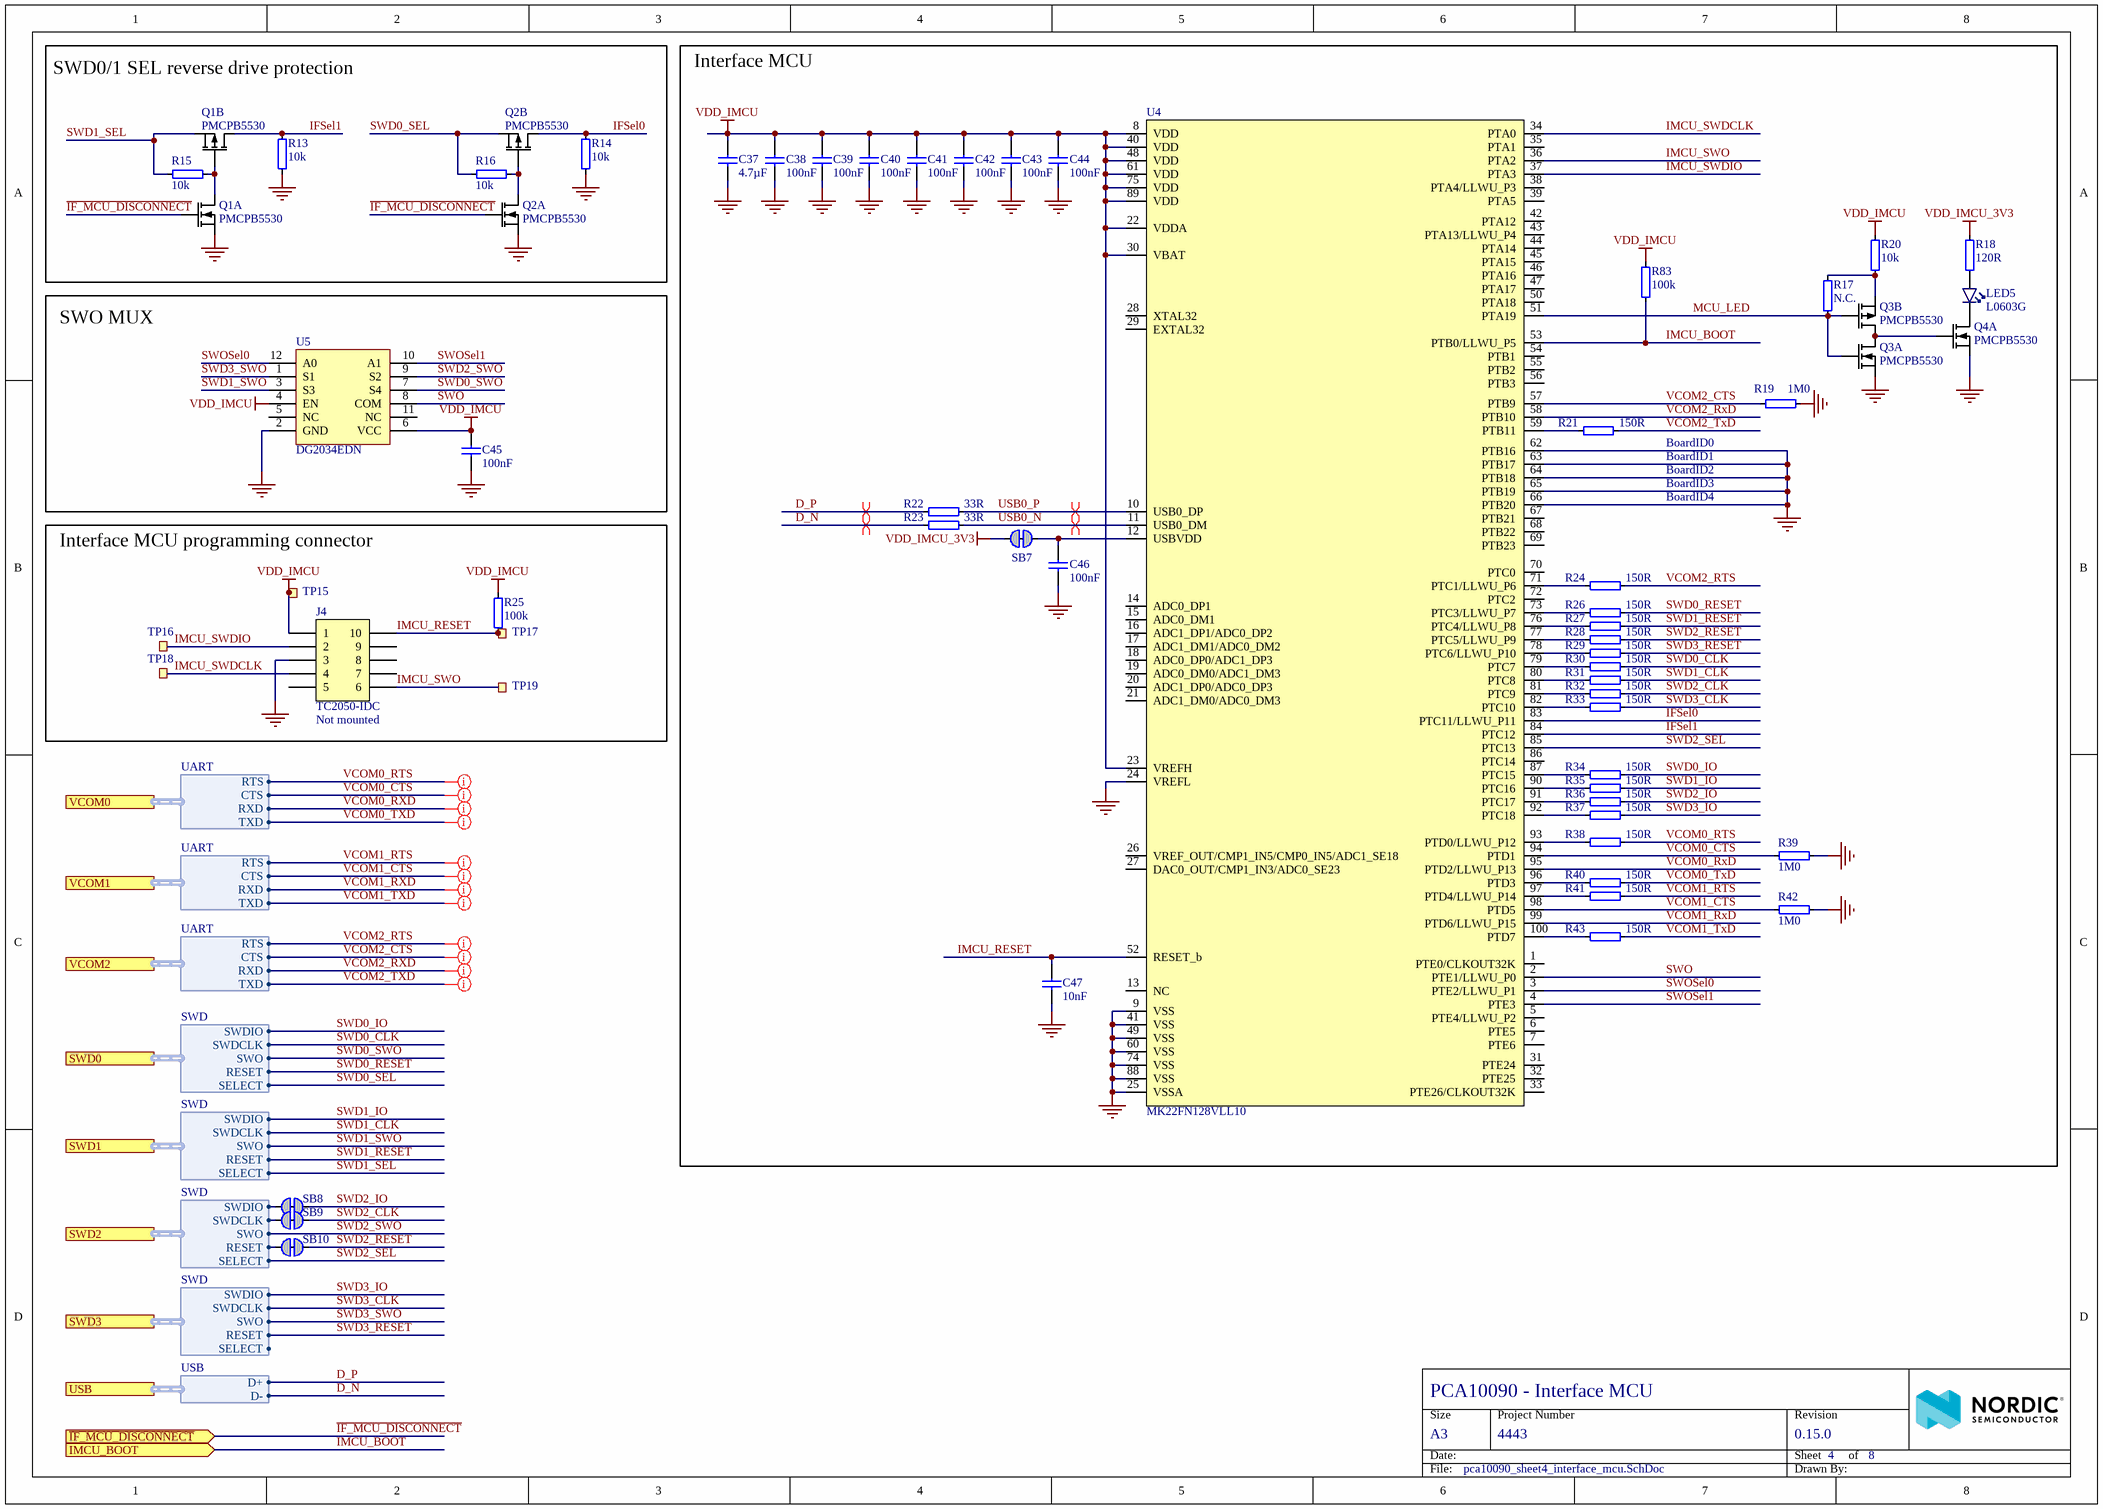
[diagram p3: pca10090_sheet4_interface_mcu.SchDoc]

### Parts
C37  4.7µF  [CAPC1005X04L]
C38  100nF  [CAPC0603X03L_C]
C39  100nF  [CAPC0603X03L_C]
C40  100nF  [CAPC0603X03L_C]
C41  100nF  [CAPC0603X03L_C]
C42  100nF  [CAPC0603X03L_C]
C43  100nF  [CAPC0603X03L_C]
C44  100nF  [CAPC0603X03L_C]
C45  100nF  [CAPC0603X03L_C]
C46  100nF  [CAPC0603X03L_C]
C47  10nF  [CAPC0603X03L_C]
J4  TC2050-IDC  Assembly: Not mounted  [TC2050-IDC-NLFP]  (no BOM)
LED5  L0603G  [LED_0603_G]
Q1  PMCPB5530  [PMCPB5530X]  (parts A,B of 2)
Q2  PMCPB5530  [PMCPB5530X]  (parts A,B of 2)
Q3  PMCPB5530  [PMCPB5530X]  (parts A,B of 2)
Q4  PMCPB5530  [PMCPB5530X]  (part A of 2)
R13  10k  [RESC0603X03L_C]
R14  10k  [RESC0603X03L_C]
R15  10k  [RESC0603X03L_C]
R16  10k  [RESC0603X03L_C]
R17  N.C.  [RESC0603X03L_C_NC]
R18  120R  [RESC0603X03L_C]
R19  1M0  [RESC0603X03L_C]
R20  10k  [RESC0603X03L_C]
R21  150R  [RESC0603X03L_C]
R22  33R  [RESC0603X03L_C]
R23  33R  [RESC0603X03L_C]
R24  150R  [RESC0603X03L_C]
R25  100k  [RESC0603X03L_C]
R26  150R  [RESC0603X03L_C]
R27  150R  [RESC0603X03L_C]
R28  150R  [RESC0603X03L_C]
R29  150R  [RESC0603X03L_C]
R30  150R  [RESC0603X03L_C]
R31  150R  [RESC0603X03L_C]
R32  150R  [RESC0603X03L_C]
R33  150R  [RESC0603X03L_C]
R34  150R  [RESC0603X03L_C]
R35  150R  [RESC0603X03L_C]
R36  150R  [RESC0603X03L_C]
R37  150R  [RESC0603X03L_C]
R38  150R  [RESC0603X03L_C]
R39  1M0  [RESC0603X03L_C]
R40  150R  [RESC0603X03L_C]
R41  150R  [RESC0603X03L_C]
R42  1M0  [RESC0603X03L_C]
R43  150R  [RESC0603X03L_C]
R83  100k  [RESC0603X03L_C]
SB7  Solderbridge  [Solderbridge_Shorted]  (value not drawn)  (net tie, no BOM)
SB8  Solderbridge  [Solderbridge_Shorted]  (value not drawn)  (net tie, no BOM)
SB9  Solderbridge  [Solderbridge_Shorted]  (value not drawn)  (net tie, no BOM)
SB10  Solderbridge  [Solderbridge_Shorted]  (value not drawn)  (net tie, no BOM)
TP15  Ø1.5mm,SMD  [TP_SMD_Ø1.5mm]  (value not drawn)  (no BOM)
TP16  Ø1.5mm,SMD  [TP_SMD_Ø1.5mm]  (value not drawn)  (no BOM)
TP17  Ø1.5mm,SMD  [TP_SMD_Ø1.5mm]  (value not drawn)  (no BOM)
TP18  Ø1.5mm,SMD  [TP_SMD_Ø1.5mm]  (value not drawn)  (no BOM)
TP19  Ø1.5mm,SMD  [TP_SMD_Ø1.5mm]  (value not drawn)  (no BOM)
U4  MK22FN128VLL10  [TSQFP50P1600X1600X160-100N]
U5  DG2034EDN  [DG2034EDN]

### Blocks framed on the sheet
SWD0/1 SEL reverse drive protection: Q1 Q2 R13-R16
Interface MCU: C37-C44 C46 C47 LED5 Q3 Q4 R17-R24 R26-R43 R83 SB7 U4
SWO MUX: C45 U5
Interface MCU programming connector: J4 R25 TP15-TP19

### Ports
IMCU_BOOT (in), SWD0 (harness SWD), SWD1 (harness SWD), SWD2 (harness SWD), SWD3 (harness SWD), USB (harness USB), VCOM0 (harness UART), VCOM1 (harness UART), VCOM2 (harness UART), ~{IF_MCU_DISCONNECT} (in)

### Harnesses
UART: RTS, CTS, RXD, TXD
SWD: SWDIO, SWDCLK, SWO, RESET, SELECT
USB: D+, D-

### Nets
GND: C37.2 C38.1 C39.1 C40.2 C41.1 C42.1 C43.1 C44.1 C45.2 C46.2 C47.1 J4.3 Q1.1(S1) Q2.1(S1) Q3.1(S1) Q4.1(S1) R13.1 R14.2 R19.2 R39.2 R42.2 U4.9(VSS) U4.24(VREFL) U4.25(VSSA) U4.41(VSS) U4.49(VSS) U4.60(VSS) U4.62(PTB16) U4.63(PTB17) U4.64(PTB18) U4.65(PTB19) U4.66(PTB20) U4.74(VSS) U4.88(VSS) U5.2(GND)
VDD_IMCU: C37.1 C38.2 C39.2 C40.1 C41.2 C42.2 C43.2 C44.2 C45.1 J4.1 R20.1 R25.2 R83.2 TP15.1 U4.8(VDD) U4.22(VDDA) U4.23(VREFH) U4.30(VBAT) U4.40(VDD) U4.48(VDD) U4.61(VDD) U4.75(VDD) U4.89(VDD) U5.4(EN) U5.6(VCC)
VDD_IMCU_3V3: R18.2 SB7.2
D_N: R23.1 ; port USB.D-
D_P: R22.1 ; port USB.D+
~{IF_MCU_DISCONNECT}: Q1.2(G1) Q2.2(G1) ; port ~{IF_MCU_DISCONNECT}
IFSel0: Q2.3(D2) R14.1 U4.83(PTC11/LLWU_P11)
IFSel1: Q1.3(D2) R13.2 U4.84(PTC12)
IMCU_BOOT: R83.1 U4.53(PTB0/LLWU_P5) ; port IMCU_BOOT
IMCU_RESET: C47.2 J4.10 R25.1 TP17.1 U4.52(RESET_b)
IMCU_SWDCLK: J4.4 TP18.1 U4.34(PTA0)
IMCU_SWDIO: J4.2 TP16.1 U4.37(PTA3)
IMCU_SWO: J4.6 TP19.1 U4.36(PTA2)
MCU_LED: Q3.2(G1) Q3.5(G2) R17.1 U4.51(PTA19)
nRF52_P0.18/RESET: SB10.1 ; port SWD2.RESET
nRF52_SWDCLK: SB9.1 ; port SWD2.SWDCLK
nRF52_SWDIO: SB8.1 ; port SWD2.SWDIO
SWD0_CLK: R30.2 ; port SWD0.SWDCLK
SWD0_IO: R34.2 ; port SWD0.SWDIO
SWD0_RESET: R26.2 ; port SWD0.RESET
SWD0_SEL: Q2.4(S2) R16.2 ; port SWD0.SELECT
SWD0_SWO: U5.7(S4) ; port SWD0.SWO
SWD1_CLK: R31.2 ; port SWD1.SWDCLK
SWD1_IO: R35.2 ; port SWD1.SWDIO
SWD1_RESET: R27.2 ; port SWD1.RESET
SWD1_SEL: Q1.4(S2) R15.1 ; port SWD1.SELECT
SWD1_SWO: U5.3(S3) ; port SWD1.SWO
SWD2_CLK: R32.2 SB9.2
SWD2_IO: R36.2 SB8.2
SWD2_RESET: R28.2 SB10.2
SWD2_SEL: U4.85(PTC13) ; port SWD2.SELECT
SWD2_SWO: U5.9(S2) ; port SWD2.SWO  [project net nRF52_P1.00]
SWD3_CLK: R33.2 ; port SWD3.SWDCLK
SWD3_IO: R37.2 ; port SWD3.SWDIO
SWD3_RESET: R29.2 ; port SWD3.RESET
SWD3_SWO: U5.1(S1) ; port SWD3.SWO
SWO: U4.2(PTE1/LLWU_P0) U5.8(COM)
SWOSel0: U4.3(PTE2/LLWU_P1) U5.12(A0)
SWOSel1: U4.4(PTE3) U5.10(A1)
USB0_N: R23.2 U4.11(USB0_DM)
USB0_P: R22.2 U4.10(USB0_DP)
VCOM0_CTS: R39.1 U4.94(PTD1) ; port VCOM0.CTS
VCOM0_RTS: R38.2 ; port VCOM0.RTS
VCOM0_RxD: U4.95(PTD2/LLWU_P13) ; port VCOM0.RXD
VCOM0_TxD: R40.2 ; port VCOM0.TXD
VCOM1_CTS: R42.1 U4.98(PTD5) ; port VCOM1.CTS
VCOM1_RTS: R41.2 ; port VCOM1.RTS
VCOM1_RxD: U4.99(PTD6/LLWU_P15) ; port VCOM1.RXD
VCOM1_TxD: R43.2 ; port VCOM1.TXD
VCOM2_CTS: R19.1 U4.57(PTB9) ; port VCOM2.CTS
VCOM2_RTS: R24.2 ; port VCOM2.RTS
VCOM2_RxD: U4.58(PTB10) ; port VCOM2.RXD
VCOM2_TxD: R21.2 ; port VCOM2.TXD
NetC46_1: C46.1 SB7.1 U4.12(USBVDD)
NetLED5_1: LED5.1(C) Q4.6(D1)
NetLED5_2: LED5.2(A) R18.1
NetQ1_5: Q1.5(G2) Q1.6(D1) R15.2
NetQ2_5: Q2.5(G2) Q2.6(D1) R16.1
NetQ3_3: Q3.3(D2) Q3.6(D1) Q4.2(G1)
NetQ3_4: Q3.4(S2) R17.2 R20.2
NetR21_1: R21.1 U4.59(PTB11)
NetR24_1: R24.1 U4.71(PTC1/LLWU_P6)
NetR26_1: R26.1 U4.73(PTC3/LLWU_P7)
NetR27_1: R27.1 U4.76(PTC4/LLWU_P8)
NetR28_1: R28.1 U4.77(PTC5/LLWU_P9)
NetR29_1: R29.1 U4.78(PTC6/LLWU_P10)
NetR30_1: R30.1 U4.79(PTC7)
NetR31_1: R31.1 U4.80(PTC8)
NetR32_1: R32.1 U4.81(PTC9)
NetR33_1: R33.1 U4.82(PTC10)
NetR34_1: R34.1 U4.87(PTC15)
NetR35_1: R35.1 U4.90(PTC16)
NetR36_1: R36.1 U4.91(PTC17)
NetR37_1: R37.1 U4.92(PTC18)
NetR38_1: R38.1 U4.93(PTD0/LLWU_P12)
NetR40_1: R40.1 U4.96(PTD3)
NetR41_1: R41.1 U4.97(PTD4/LLWU_P14)
NetR43_1: R43.1 U4.100(PTD7)

Not connected (* = marked no-connect by the designer): J4 5 7 8 9; U4 1(PTE0/CLKOUT32K) 5(PTE4/LLWU_P2) 6(PTE5) 7(PTE6) 13(NC) 14(ADC0_DP1) 15(ADC0_DM1) 16(ADC1_DP1/ADC0_DP2) 17(ADC1_DM1/ADC0_DM2) 18(ADC0_DP0/ADC1_DP3) 19(ADC0_DM0/ADC1_DM3) 20(ADC1_DP0/ADC0_DP3) 21(ADC1_DM0/ADC0_DM3) 26(VREF_OUT/CMP1_IN5/CMP0_IN5/ADC1_SE18) 27(DAC0_OUT/CMP1_IN3/ADC0_SE23) 28(XTAL32) 29(EXTAL32) 31(PTE24) 32(PTE25) 33(PTE26/CLKOUT32K) 35(PTA1) 38(PTA4/LLWU_P3) 39(PTA5) 42(PTA12) 43(PTA13/LLWU_P4) 44(PTA14) 45(PTA15) 46(PTA16) 47(PTA17) 50(PTA18) 54(PTB1) 55(PTB2) 56(PTB3) 67(PTB21) 68(PTB22) 69(PTB23) 70(PTC0) 72(PTC2) 86(PTC14); U5 5(NC) 11(NC)

### Layout directives
differential pair: D_N, D_P, USB0_N, USB0_P
net class UART: VCOM0_CTS, VCOM0_RTS, VCOM0_RxD, VCOM0_TxD, VCOM1_CTS, VCOM1_RTS, VCOM1_RxD, VCOM1_TxD, VCOM2_CTS, VCOM2_RTS, VCOM2_RxD, VCOM2_TxD

### Notes on the sheet
- BoardID0
- BoardID1
- BoardID2
- BoardID3
- BoardID4
- Size
- Date:
- A3
- Project Number
- Sheet         of
- Revision
- File:
- Drawn By:

### Library data of the parts
C37 = C0402-4µ7: Capacitor, X5R, ±20%; Part number IPS: 00000001251, 00000007165; Note: 10V; Artikkelnr Noca: 20039482; Part Number: C0402-4µ7; Manufacturer: *; Manufacturer Part Number: *; ComponentLink1URL: *; ComponentLink1Description: Datasheet; ComponentLink2URL: *; ComponentLink2Description: Supplier link; HelpURL: *; Footprint Doc: 0402; LatestRevisionDate: 2017-11-09; Pin Count: 2; Publisher: Nordic Semiconductor; Published: 2009-05-08; Value: 4.7µF; Supplier 1: Digi-Key; Supplier Part Number 1: 490-13252-1-ND; Supplier 2: *; Supplier Part Number 2: *
C38-C46 = C0201-100n: as C22 on sheet pca10090_sheet3_nrf52840; Part Number: C0201-100n; Manufacturer: *; Manufacturer Part Number: *; ComponentLink1URL: *; ComponentLink1Description: Datasheet; ComponentLink2URL: *; ComponentLink2Description: Supplier link; HelpURL: *; Footprint Doc: 0201; LatestRevisionDate: 2017-11-09; Pin Count: 2; Publisher: Nordic Semiconductor; Published: 2014-11-13; Value: 100nF; Supplier 1: *; Supplier Part Number 1: *; Supplier 2: *; Supplier Part Number 2: *
C47 = C0201-10n: Capacitor, X7R, ±10%; Part number IPS: 00000003480; Note: 10V; Artikkelnr Noca: N.A.; Part Number: C0201-10n; Manufacturer: *; Manufacturer Part Number: *; ComponentLink1URL: *; ComponentLink1Description: Datasheet; ComponentLink2URL: *; ComponentLink2Description: Supplier link; HelpURL: *; Footprint Doc: 0201; LatestRevisionDate: 2017-11-09; Pin Count: 2; Publisher: Nordic Semiconductor; Published: 2014-11-13; Value: 10nF; Supplier 1: *; Supplier Part Number 1: *; Supplier 2: *; Supplier Part Number 2: *
J4 = TC2050-IDC-NLFP: CBL PLUG-OF-NAILS 10-PIN; Manufacturer: Tag-Connect LLC; Artikkelnr Noca: N.A.; Part Number: TC2050-IDC-NLFP; Manufacturer Part Number: TC2050-IDC-NLFP; LatestRevisionDate: 2012-11-21; Publisher: Nordic Semiconductor; Published: 2012-11-21; Value: TC2050-IDC; Pin Count: 10; Footprint Doc: TC2050-IDC-NLFP; Part number IPS: N.A.; ComponentLink1URL: *; ComponentLink1Description: Datasheet; ComponentLink2URL: *; ComponentLink2Description: Supplier link; HelpURL: http://www.tag-connect.com/Materials/TC2050-IDC%20Datasheet.pdf; Supplier 1: Digi-Key; Supplier Part Number 1: TC2050-IDC-NL-ND; Supplier 2: *; Supplier Part Number 2: *
LED5 = VS 25C7M5: LED, Green, 0603, 573nm, Vf=2.0V, 24mcd, - 40 to +85°C; Manufacturer: Victory Electronics; Part number IPS: N.A.; Artikkelnr Noca: 13019193; Part Number: VS 25C7M5; Manufacturer Part Number: VS 25C7M5; Footprint Doc: 0603; LatestRevisionDate: 2017-08-21; Pin Count: 2; Publisher: Nordic Semiconductor; Published: 2017-08-21; Value: L0603G; Note: *; ComponentLink1URL: *; ComponentLink1Description: Datasheet; ComponentLink2URL: *; ComponentLink2Description: Supplier link; HelpURL: \\hizz\pro\app9717\Datasheet\optoelectronics\Victory Electronics\VS 25C7M5.pdf; Supplier 1: EC Partner; Supplier Part Number 1: *; Supplier 2: *; Supplier Part Number 2: *
Q1-Q4 = PMCPB5530X,115: Mosfet Array N and P-Channel 20V 4A (Ta), 3.4A (Ta) 490mW Surface Mount 6-HUSON-EP (2x2); Manufacturer: Nexperia; Part number IPS: 00000001918; Artikkelnr Noca: N.A.; Part Number: PMCPB5530X,115; Manufacturer Part Number: PMCPB5530X,115; ComponentLink1URL: https://assets.nexperia.com/documents/data-sheet/PMCPB5530X.pdf; ComponentLink1Description: Datasheet; ComponentLink2URL: https://www.digikey.com/product-detail/en/nexperia-usa-inc/PMCPB5530X115/1727-1327-1-ND/4386339; ComponentLink2Description: Supplier link; HelpURL: https://www.nexperia.com/products/mosfets/small-signal-mosfets/PMCPB5530X.html; Footprint Doc: 6-UDFN; LatestRevisionDate: 2018-04-30; Pin Count: 8; Publisher: Nordic Semiconductor; Published: 2018-04-30; Value: PMCPB5530; Note: *; Supplier 1: Digi-Key; Supplier Part Number 1: 1727-1327-1-ND; Supplier 2: Mouser; Supplier Part Number 2: 771-PMCPB5530X115
R13-R16 R20 = R0201-10k: Resistor, ±1%, 0.05W; Part number IPS: 00000001255; Note: Chip Res 1%; Artikkelnr Noca: N.A.; Part Number: R0201-10k; Manufacturer: *; Manufacturer Part Number: *; ComponentLink1URL: *; ComponentLink1Description: Datasheet; ComponentLink2URL: *; ComponentLink2Description: Supplier link; HelpURL: *; Footprint Doc: 0201; LatestRevisionDate: 2014-11-13; Pin Count: 2; Publisher: Nordic Semiconductor; Published: 2014-11-13; Value: 10k; Supplier 1: *; Supplier Part Number 1: *; Supplier 2: *; Supplier Part Number 2: *
R17 = R0201-N.C.: Not mounted; Note: Chip Res; Artikkelnr Noca: N.A.; Assembly: Not mounted; Part Number: R0201-N.C.; Manufacturer: *; Manufacturer Part Number: *; ComponentLink1URL: *; ComponentLink1Description: Datasheet; ComponentLink2URL: *; ComponentLink2Description: Supplier link; HelpURL: *; Footprint Doc: 0201; LatestRevisionDate: 2014-11-13; Pin Count: 2; Publisher: Nordic Semiconductor; Published: 2014-11-13; Value: N.C.; Supplier 1: *; Supplier Part Number 1: *; Supplier 2: *; Supplier Part Number 2: *; Part number IPS: N.A.
R18 = R0201-120: Resistor, ±1%, 0.05W; Part number IPS: 00000000880; Note: Chip Res 1%; Artikkelnr Noca: N.A.; Part Number: R0201-120; Manufacturer: *; Manufacturer Part Number: *; ComponentLink1URL: *; ComponentLink1Description: Datasheet; ComponentLink2URL: *; ComponentLink2Description: Supplier link; HelpURL: *; Footprint Doc: 0201; LatestRevisionDate: 2014-11-13; Pin Count: 2; Publisher: Nordic Semiconductor; Published: 2014-11-13; Value: 120R; Supplier 1: *; Supplier Part Number 1: *; Supplier 2: *; Supplier Part Number 2: *
R19 R39 R42 = R0201-1M0: as R11 on sheet pca10090_sheet3_nrf52840; Part Number: R0201-1M0; Manufacturer: *; Manufacturer Part Number: *; ComponentLink1URL: *; ComponentLink1Description: Datasheet; ComponentLink2URL: *; ComponentLink2Description: Supplier link; HelpURL: *; Footprint Doc: 0201; LatestRevisionDate: 2014-11-13; Pin Count: 2; Publisher: Nordic Semiconductor; Published: 2014-11-13; Value: 1M0; Supplier 1: *; Supplier Part Number 1: *; Supplier 2: *; Supplier Part Number 2: *
R21 R24 R26-R38 R40 R41 R43 = R0201-150: Resistor, ±1%, 0.05W; Part number IPS: 00000001420; Note: Chip Res 1%; Artikkelnr Noca: N.A.; Part Number: R0201-150; Manufacturer: *; Manufacturer Part Number: *; ComponentLink1URL: *; ComponentLink1Description: Datasheet; ComponentLink2URL: *; ComponentLink2Description: Supplier link; HelpURL: *; Footprint Doc: 0201; LatestRevisionDate: 2014-11-13; Pin Count: 2; Publisher: Nordic Semiconductor; Published: 2014-11-13; Value: 150R; Supplier 1: *; Supplier Part Number 1: *; Supplier 2: *; Supplier Part Number 2: *
R22 R23 = R0201-33R: Resistor, ±1%, 0.05W; Part number IPS: 00000003623; Note: Chip Res 1%; Artikkelnr Noca: N.A.; Part Number: R0201-33R; Manufacturer: *; Manufacturer Part Number: *; ComponentLink1URL: *; ComponentLink1Description: Datasheet; ComponentLink2URL: *; ComponentLink2Description: Supplier link; HelpURL: *; Footprint Doc: 0201; LatestRevisionDate: 2014-11-13; Pin Count: 2; Publisher: Nordic Semiconductor; Published: 2014-11-13; Value: 33R; Supplier 1: *; Supplier Part Number 1: *; Supplier 2: *; Supplier Part Number 2: *
R25 R83 = R0201-100k: as R12 on sheet pca10090_sheet3_nrf52840; Part Number: R0201-100k; Manufacturer: *; Manufacturer Part Number: *; ComponentLink1URL: *; ComponentLink1Description: Datasheet; ComponentLink2URL: *; ComponentLink2Description: Supplier link; HelpURL: *; Footprint Doc: 0201; LatestRevisionDate: 2014-11-13; Pin Count: 2; Publisher: Nordic Semiconductor; Published: 2014-11-13; Value: 100k; Supplier 1: *; Supplier Part Number 1: *; Supplier 2: *; Supplier Part Number 2: *
SB7-SB10 = Solderbridge Shorted: as SB3 on sheet pca10090_sheet3_nrf52840; Part Number: Solderbridge Shorted; Manufacturer: *; Manufacturer Part Number: *; ComponentLink1URL: *; ComponentLink1Description: Datasheet; ComponentLink2URL: *; ComponentLink2Description: Supplier link; HelpURL: *; Footprint Doc: Solderbridge_Shorted; LatestRevisionDate: 2012-08-07; Pin Count: 2; Publisher: Nordic Semiconductor; Published: 2012-08-07; Value: Solderbridge; Note: *; Supplier 1: *; Supplier Part Number 1: *; Supplier 2: *; Supplier Part Number 2: *; Part number IPS: N.A.
TP15-TP19 = TP_SMD_Ø1.5MM: as TP10 on sheet pca10090_sheet3_nrf52840; Part Number: TP_SMD_Ø1.5MM; Manufacturer Part Number: *; ComponentLink1URL: *; ComponentLink1Description: Datasheet; ComponentLink2URL: *; ComponentLink2Description: Supplier link; HelpURL: *; Footprint Doc: TP_SMD_Ø1.5mm; LatestRevisionDate: 2016-06-02; Pin Count: 1; Publisher: Nordic Semiconductor; Published: 2016-06-02; Value: Ø1.5mm,SMD; Note: *; Part number IPS: N.A.; Supplier 1: *; Supplier Part Number 1: *; Supplier 2: *; Supplier Part Number 2: *
U4 = MK22FN128VLL10: 100MHz Cortex-M4F Performance MCU, 128kB Flash, 24kB SRAM, Full-Speed USB; Manufacturer: NXP; Part number IPS: 00000001366; Artikkelnr Noca: N.A.; Part Number: MK22FN128VLL10; Manufacturer Part Number: MK22FN128VLL10; ComponentLink1URL: http://cache.freescale.com/files/microcontrollers/doc/data_sheet/K22P121M100SF9.pdf; ComponentLink1Description: Datasheet; ComponentLink2URL: https://cache.nxp.com/docs/en/package-information/98ASS23308W.pdf; ComponentLink2Description: Supplier link; HelpURL: *; Footprint Doc: LQFP-100; LatestRevisionDate: 2019-03-01; Pin Count: 100; Publisher: Nordic Semiconductor; Published: 2018-05-10; Value: MK22FN128VLL10; Note: *; Supplier 1: Digi-Key; Supplier Part Number 1: MK22FN128VLL10-ND; Supplier 2: Mouser; Supplier Part Number 2: 841-MK22FN128VLL10
U5 = DG2034EDN: POWER DOWN FAULT PROTECTED,1.8VT; Manufacturer: Vishay Siliconix; Manufacturer Part Number: DG2034EDN-T1-GE4; Part number IPS: 00000001429; Artikkelnr Noca: N.A.; Part Number: DG2034EDN; ComponentLink1URL: http://www.vishay.com/docs/73172/dg2034e.pdf; ComponentLink1Description: Datasheet; ComponentLink2Description: Supplier link; Footprint Doc: 12-QFN; LatestRevisionDate: 2018-05-30; Pin Count: 12; Publisher: Nordic Semiconductor; Published: 2018-05-30; Value: DG2034EDN; Note: *; Supplier 1: Digi-Key; Supplier Part Number 1: DG2034EDN-T1-GE4CT-ND; Supplier 2: Mouser; Supplier Part Number 2: 78-DG2034EDN-T1-GE4